# EAGLE design Amp_Circuit_Design_v8 (1) (EAGLE 9.6.2)
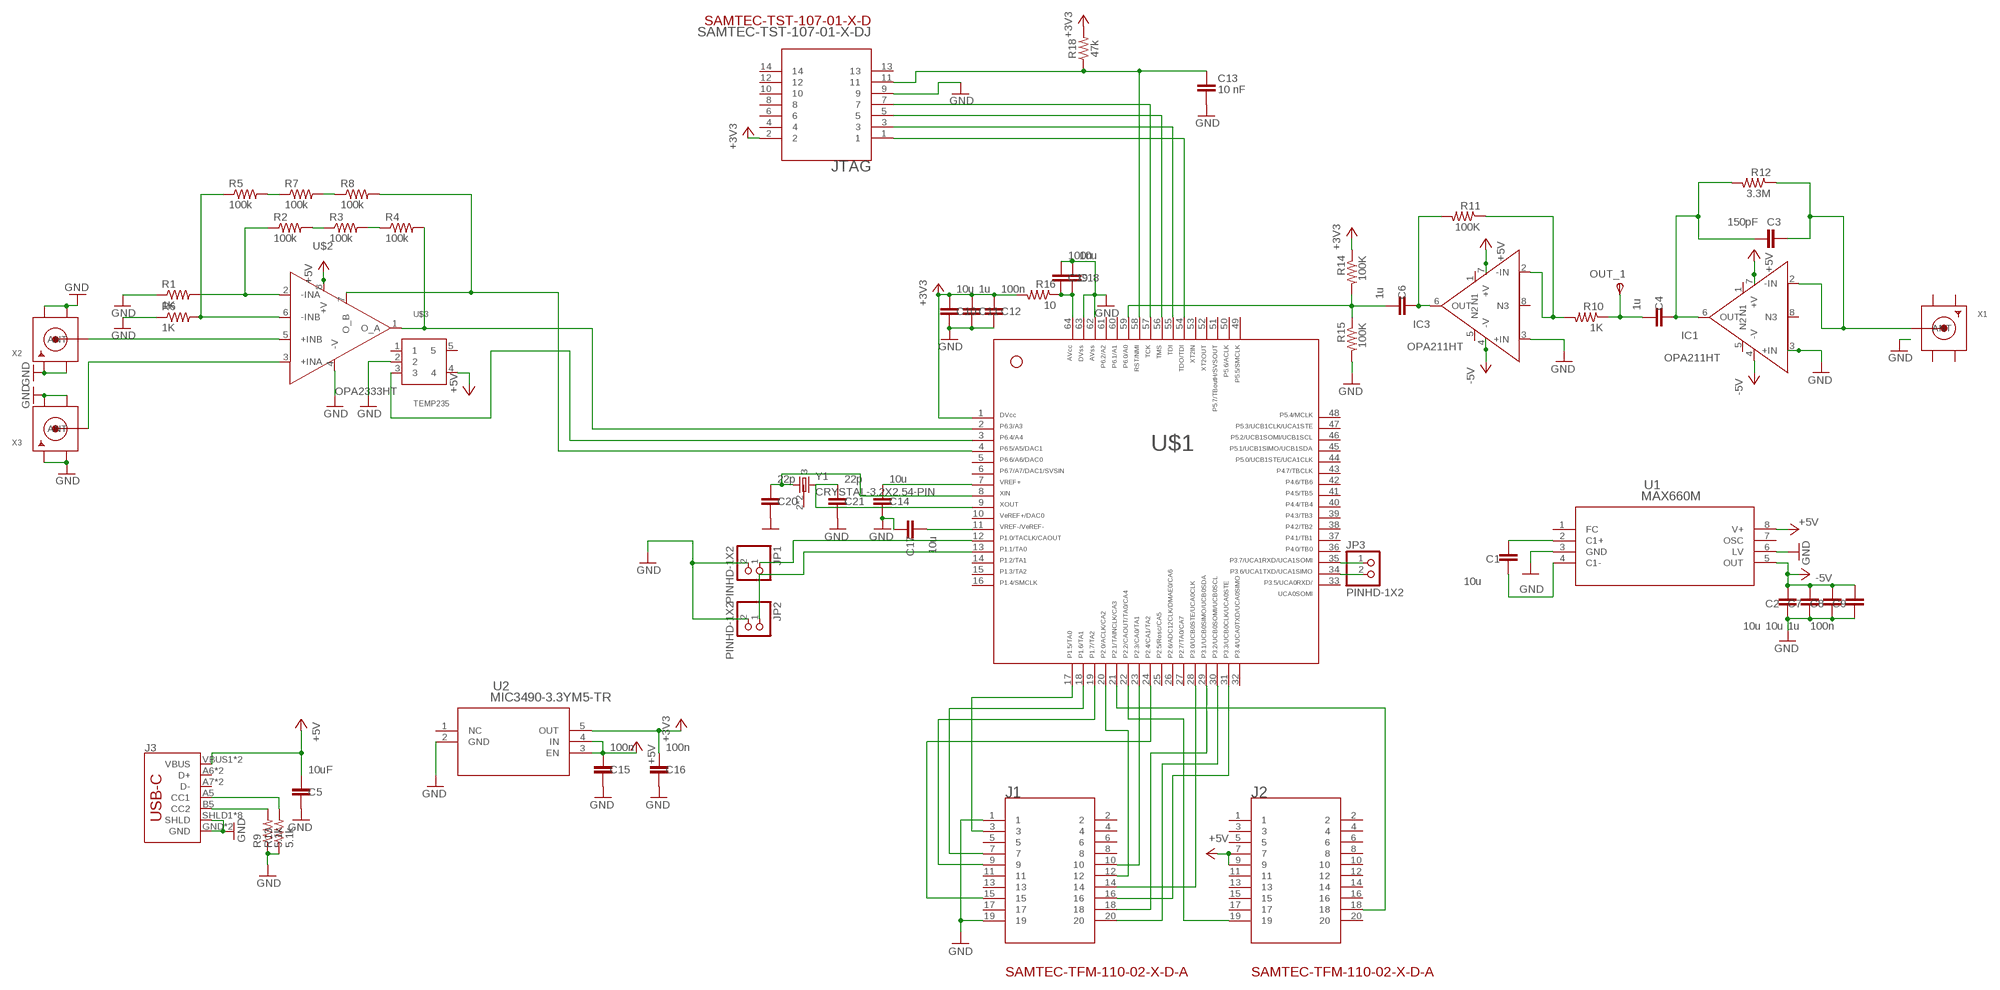
[diagram p0: schematic, sheet 1]

## Parts
C1  10u  C0603  [0603-C]
C2  10u  C0603  [0603-C]
C3  150pF  C0603  [0603-C]
C4  1u  C0603  [0603-C]
C5  10uF  C0603  [0603-C]
C6  1u  C0603  [0603-C]
C7  10u  C0603  [0603-C]
C8  1u  C0603  [0603-C]
C9  100n  C0603  [0603-C]
C10  10u  C0603  [0603-C]
C11  1u  C0603  [0603-C]
C12  100n  C0603  [0603-C]
C13  10 nF  C0603  [0603-C]
C14  10u  C0603  [0603-C]
C15  100n  C0603  [0603-C]
C16  100n  C0603  [0603-C]
C17  10u  C0603  [0603-C]
C18  10u  C0603  [0603-C]
C19  100n  C0603  [0603-C]
C20  22p  C0603  [0603-C]
C21  22p  C0603  [0603-C]
IC1  OPA211HT  [HKJ(R-CDFP-F8)]
IC3  OPA211HT  [HKJ(R-CDFP-F8)]
J1  SAMTEC-TFM-110-02-X-D-AJ  [SAMTEC-TFM-110-02-X-D-A]
J2  SAMTEC-TFM-110-02-X-D-AJ  [SAMTEC-TFM-110-02-X-D-A]
J3  SPARKFUN-CONNECTORS_USB_C16PIN  [SPARKFUN-CONNECTORS_USB-C-16P]
JP1  PINHD-1X2  [1X02]
JP2  PINHD-1X2  [1X02]
JP3  PINHD-1X2  [1X02]
JTAG  SAMTEC-TST-107-01-X-DJ  [SAMTEC-TST-107-01-X-D]
OUT_1  TPSB1,27  [B1,27]
R1  1K  R0603  [0603-R]
R2  100k  R0603  [0603-R]
R3  100k  R0603  [0603-R]
R4  100k  R0603  [0603-R]
R5  100k  R0603  [0603-R]
R6  1K  R0603  [0603-R]
R7  100k  R0603  [0603-R]
R8  100k  R0603  [0603-R]
R9  5.1k  R0603  [0603-R]
R10  1K  R0603  [0603-R]
R11  100K  R0603  [0603-R]
R12  3.3M  R0603  [0603-R]
R13  5.1k  R0603  [0603-R]
R14  100K  R0603  [0603-R]
R15  100K  R0603  [0603-R]
R16  10  R0603  [0603-R]
R18  47k  R0603  [0603-R]
U1  MAX660M  [M08A]
U2  MIC3490-3.3YM5-TR  [SOT-23-5_OT_MCH]
U$1  F261X---PM64  [PM/PAG64]
U$2  OPA2333HT  [D(R-PDSO-G8)]
U$3  TEMP235  [DCK(R-PDSO-G5)]
X1  SMACONNECTOR_EDGE  [SMA_EDGELAUNCH]
X2  SMACONNECTOR_EDGE  [SMA_EDGELAUNCH]
X3  SMACONNECTOR_EDGE  [SMA_EDGELAUNCH]
Y1  CRYSTAL-3.2X2.54-PIN  [XTAL-3.2X2.5]

## Nets
+3V3: C10.2 C11.2 C12.2 C16.2 JTAG.2 R14.1 R16.2 R18.2 U2.5(OUT) U$1.1
+5V: C5.2 C15.2 IC1.7(+V) IC3.7(+V) J2.7 J2.9 J3.VBUS1(VBUS) J3.VBUS2(VBUS) U1.8(V+) U2.3(EN) U2.4(IN) U$2.8(+V) U$3.4
-5V: C2.1 C7.1 C8.1 C9.1 IC1.4(-V) IC3.4(-V) U1.5(OUT)
GND: C2.2 C5.1 C7.2 C8.2 C9.2 C10.1 C11.1 C12.1 C13.2 C14.1 C15.1 C16.1 C17.1 C18.2 C19.2 C20.1 C21.1 IC1.3(+IN) IC3.3(+IN) J1.1 J1.19 J3.GND J3.GND2(GND) J3.SHLD1(SHLD) J3.SHLD2(SHLD) J3.SHLD3(SHLD) J3.SHLD4(SHLD) J3.SHLD5(SHLD) J3.SHLD6(SHLD) J3.SHLD7(SHLD) J3.SHLD8(SHLD) JP1.2 JP2.2 JTAG.9 R1.1 R6.1 R9.1 R13.1 R15.2 U1.3(GND) U1.6(LV) U2.2(GND) U$1.62 U$1.63 U$2.4(-V) U$3.2 X2.GND@1(GND4) X2.GND@2(GND3) X2.GND@3(GND2) X2.GND@4(GND1) X3.GND@1(GND4) X3.GND@2(GND3) X3.GND@3(GND2) X3.GND@4(GND1)
N$1: R8.2 U$1.4 U$2.7(O_B)
N$2: R4.2 U$1.2 U$2.1(O_A)
N$3: U$2.3(+INA) X3.P(ANT)
N$4: U$1.3 U$3.3
N$5: R1.2 R2.1 U$2.2(-INA)
N$6: R5.1 R6.2 U$2.6(-INB)
N$7: U$2.5(+INB) X2.P(ANT)
N$8: C1.1 U1.2(C1+)
N$9: C3.2 C4.1 IC1.6(OUT) R12.2
N$10: C4.2 OUT_1.TP(PP) R10.1
N$11: R5.2 R7.1
N$12: R2.2 R3.1
N$13: R3.2 R4.1
N$14: IC3.2(-IN) R10.2 R11.1
N$15: R7.2 R8.1
N$16: J3.B5(CC2) R9.2
N$17: C6.2 R14.2 R15.1 U$1.59
N$18: C3.1 IC1.2(-IN) R12.1 X1.P(ANT)
N$19: J1.14 U$1.28
N$20: J3.A5(CC1) R13.2
N$21: JP1.1 U$1.12
N$22: C14.2 U$1.7
N$23: J1.18 U$1.29
N$24: J1.20 U$1.30
N$25: C6.1 IC3.6(OUT) R11.2
N$26: J1.16 U$1.31
N$27: JTAG.1 U$1.54
N$28: JTAG.3 U$1.55
N$29: JTAG.5 U$1.56
N$30: JTAG.7 U$1.57
N$31: C1.2 U1.4(C1-)
N$32: JP3.1 U$1.35
N$33: C13.1 JTAG.11 R18.1 U$1.58
N$34: JP3.2 U$1.34
N$35: C20.2 U$1.8 Y1.1
N$36: C18.1 C19.1 R16.1 U$1.64
N$37: C17.2 U$1.11
N$38: JP2.1 U$1.13
N$39: J1.3 U$1.17
N$40: J1.7 U$1.18
N$41: J1.9 U$1.19
N$42: J1.12 U$1.20
N$43: J2.18 U$1.21
N$44: J2.19 U$1.22
N$45: J1.10 U$1.23
N$46: C21.2 U$1.9 Y1.3
N$47: J1.15 U$1.24
Unconnected: IC1.1(N1) IC1.5(N2) IC1.8(N3) IC3.1(N1) IC3.5(N2) IC3.8(N3) J1.2 J1.4 J1.5 J1.6 J1.8 J1.11 J1.13 J1.17 J2.1 J2.2 J2.3 J2.4 J2.5 J2.6 J2.8 J2.10 J2.11 J2.12 J2.13 J2.14 J2.15 J2.16 J2.17 J2.20 J3.A6(D+) J3.A7(D-) J3.B6(D+) J3.B7(D-) JTAG.4 JTAG.6 JTAG.8 JTAG.10 JTAG.12 JTAG.13 JTAG.14 U1.1(FC) U1.7(OSC) U2.1(NC) U$1.5 U$1.6 U$1.10 U$1.14 U$1.15 U$1.16 U$1.25 U$1.26 U$1.27 U$1.32 U$1.33 U$1.36 U$1.37 U$1.38 U$1.39 U$1.40 U$1.41 U$1.42 U$1.43 U$1.44 U$1.45 U$1.46 U$1.47 U$1.48 U$1.49 U$1.50 U$1.51 U$1.52 U$1.53 U$1.60 U$1.61 U$3.1 U$3.5 Y1.2 Y1.4

## Power pins joined to a net without a drawn wire
GND1: X1.GND@4(GND1)
GND2: X1.GND@3(GND2)
GND3: X1.GND@2(GND3)
GND4: X1.GND@1(GND4)

## Library data of the parts
C1-C21 = comma.ai:C
IC1 IC3 = Charge_amplifier:OPA211HT
J1 J2 = SAMTEC-TFM-110-02-X-D-A:SAMTEC-TFM-110-02-X-D-A
J3 = USB-C-Breakout:SPARKFUN-CONNECTORS_USB_C: USB Type C 16Pin Connector Super Speed pins not available on the 16-pin purely SMD connector so this part is best for USB 2.0 implementations. D1 and D2 are tied together enabling D+/- no matter which way the cable is plugged into the connector. The two channel configuration pins (CC1/2) are exposed. These are normally connected to ground via 5.1k resistors but can be reconfigured for high current/high power applications.; PROD_ID: CONN-14122
JP1-JP3 = Connector:PINHD-1X2: PIN HEADER; CATEGORY: CONNECTOR; SUB-CATEGORY: PIN-HEADER
JTAG = SAMTEC-TST-107-01-X-D:SAMTEC-TST-107-01-X-D; DESCRIPTION: TST - Samtec 2.54mm Shrouded Through Hole Terminal Strip Cable Mate; DIGI-KEY_PART_NUMBER: TST-107-01-G-D-01-ND; MF: Samtec; MP: TST-107-01-G-D; PACKAGE: None; PURCHASE-URL: https://pricing.snapeda.com/search/part/TST-107-01-G-D/?ref=eda
OUT_1 = testpad:TPS: TEST PIN
R1-R16 R18 = comma.ai:R
U1 = max660:MAX660M: Switched Capacitor Voltage Converter; BASE_PN: MAX660; COMPTYPE: SwitchCap; PARTNUMBER: MAX660M; SYMBOL: NameMAX660M; TYPE: MAX660M; VENDOR: NationalSemiconductor; VERSION: 05/02/2007
U2 = MIC3490:MIC3490-3.3YM5-TR: Linear Regulator; BUILT_BY: EMA_Cory; COPYRIGHT: Copyright (C) 2018 Accelerated Designs. All rights reserved; DATASHEET: http://ww1.microchip.com/downloads/en/DeviceDoc/MIC3490-Data-Sheet-DS20006137A.pdf; MANUFACTURER_PART_NUMBER: MIC3490-3.3YM5-TR; SOURCELIBRARY: Add_to_database_2021-04-16; VENDOR: Microchip
U$1 = TI_MSP430_v16:F261X---PM64: ***MSP430F261x***PM64
U$2 = Thermocouple:OPA2333HT
U$3 = Temp_sensor:TEMP235
X1-X3 = adafruit:SMACONNECTOR: SMA Connector 90° DIP SMA Connector, 50 Ohm (4UConnector: 07259)
Y1 = comma.ai:CRYSTAL-3.2X2.5

## Board
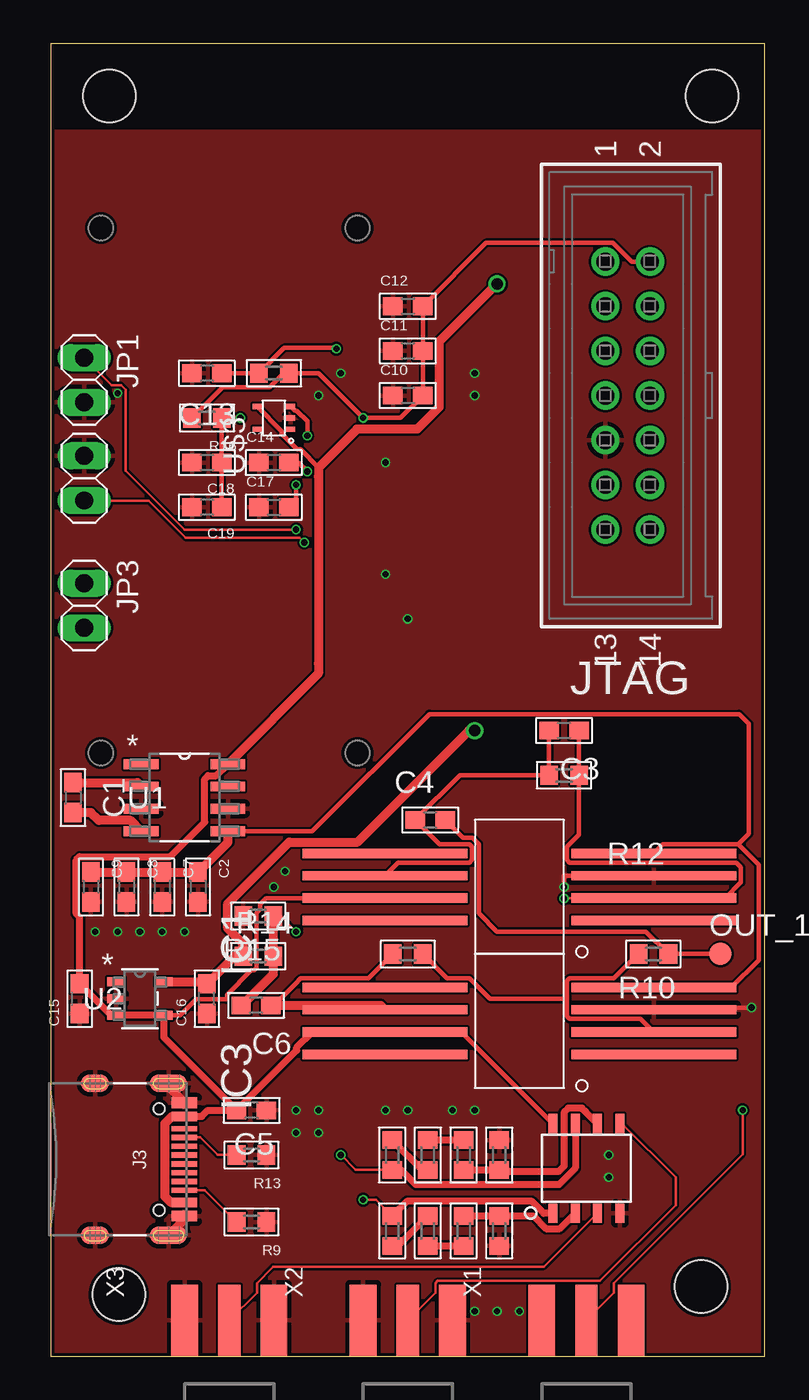
[diagram p1: board, top side]
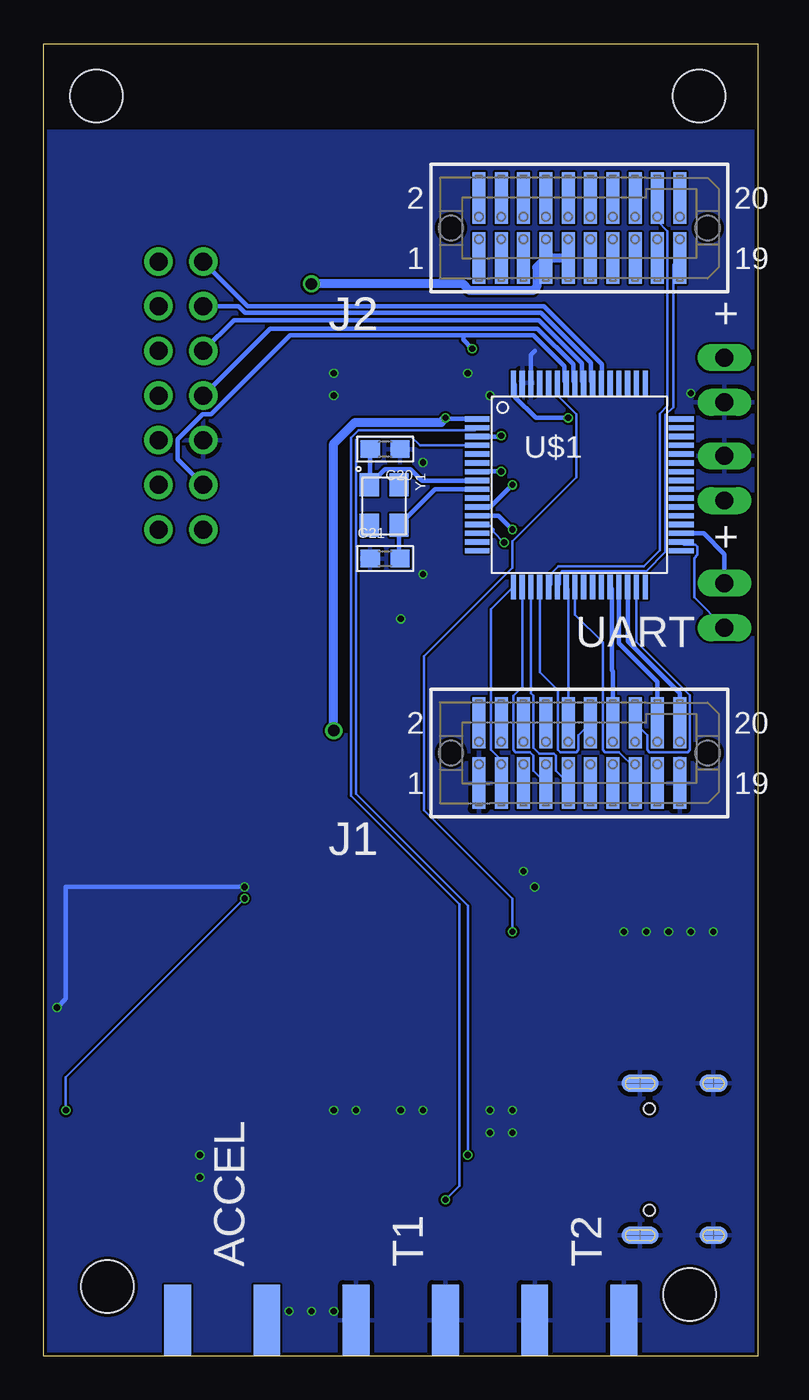
[diagram p2: board, bottom side, seen from below]

Size 40.62 x 74.6 mm. Coordinates in mm from the lower left corner, seen from the top.
Outline: 0,0 40.62,0 40.62,74.6 0,74.6 0,0
Copper layers (1*16): Top 0.035559375mm / dielectric 1.6mm / Bottom 0.035559375mm
Design rules "jlcpcb2layer": minimum track width 5mil, minimum drill 12mil, track to track 5mil, track to pad 5mil, pad to pad 5mil, via to via 5mil, smd to smd 5mil, copper to edge 8mil, drill to drill 6mil, minimum pad ring 5mil, minimum via ring 3mil, stop-mask expansion 2.5mil, vias tented up to drill 0mil, thermal gap 10mil
Holes 3 mm at 37,3.95 3.88,3.49 3.35,71.64 37.63,71.64

### Footprints (pad centres in the part's own frame; a part is rotated, then mirrored left to right if it is on the bottom)
0603-C = smd 1.1 x 1: 1 -0.85,0; 2 0.85,0
HKJ(R-CDFP-F8) = smd 0.53 x 9.4: 1 -1.905,-7.645; 2 -0.635,-7.645; 3 0.635,-7.645; 4 1.905,-7.645; 5 1.905,7.645; 6 0.635,7.645; 7 -0.635,7.645; 8 -1.905,7.645
SAMTEC-TFM-110-02-X-D-A = smd 0.74 x 2.92: 1 -5.715,-1.714; 2 -5.715,1.714; 3 -4.445,-1.714; 4 -4.445,1.714; 5 -3.175,-1.714; 6 -3.175,1.714; 7 -1.905,-1.714; 8 -1.905,1.714; 9 -0.635,-1.714; 10 -0.635,1.714; 11 0.635,-1.714; 12 0.635,1.714; 13 1.905,-1.714; 14 1.905,1.714; 15 3.175,-1.714; 16 3.175,1.714; 17 4.445,-1.714; 18 4.445,1.714; 19 5.715,-1.714; 20 5.715,1.714 | hole 1.4: 7.302,0; -7.302,0
SPARKFUN-CONNECTORS_USB-C-16P = smd 0.3 x 1.45: A5 -1.25,0; A6 -0.25,0; A7 0.25,0; A8 1.25,0; B5 1.75,0; B6 0.75,0; B7 -0.75,0; B8 -1.75,0 | smd 0.6 x 1.45: GND -3.225,0; GND2 3.225,0 | smd 1 x 2.1: SHLD1 -4.32,-0.915; SHLD2 4.32,-0.915 | smd 1 x 2.1 bottom: SHLD3 -4.32,-0.915; SHLD4 4.32,-0.915 | smd 1 x 1.6: SHLD5 -4.32,-5.095; SHLD8 4.32,-5.095 | smd 1 x 1.6 bottom: SHLD6 -4.32,-5.095; SHLD7 4.32,-5.095 | smd 0.55 x 1.45: VBUS1 -2.45,0; VBUS2 2.45,0 | hole 0.65: -2.89,-1.445; 2.89,-1.445
1X02 = drill 1.016 long: 1 -1.27,0; 2 1.27,0
SAMTEC-TST-107-01-X-D = drill 1.02 pad 1.62: 1 -7.62,-1.46; 2 -7.62,1.08; 3 -5.08,-1.46; 4 -5.08,1.08; 5 -2.54,-1.46; 6 -2.54,1.08; 7 0,-1.46; 8 0,1.08; 9 2.54,-1.46; 10 2.54,1.08; 11 5.08,-1.46; 12 5.08,1.08; 13 7.62,-1.46; 14 7.62,1.08
B1,27 = smd 1.27 x 1.27: TP 0,0
0603-R = smd 1 x 1.1: 1 -0.85,0; 2 0.85,0
M08A = smd 1.981 x 0.559: 1 -2.464,1.905; 2 -2.464,0.635; 3 -2.464,-0.635; 4 -2.464,-1.905; 5 2.464,-1.905; 6 2.464,-0.635; 7 2.464,0.635; 8 2.464,1.905
SOT-23-5_OT_MCH = smd 0.978 x 0.508: 1 -1.365,0.95; 2 -1.365,0; 3 -1.365,-0.95; 4 1.365,-0.95; 5 1.365,0.95
PM/PAG64 = smd 1.4 x 0.3: 1 -5.8,3.75; 2 -5.8,3.25; 3 -5.8,2.75; 4 -5.8,2.25; 5 -5.8,1.75; 6 -5.8,1.25; 7 -5.8,0.75; 8 -5.8,0.25; 9 -5.8,-0.25; 10 -5.8,-0.75; 11 -5.8,-1.25; 12 -5.8,-1.75; 13 -5.8,-2.25; 14 -5.8,-2.75; 15 -5.8,-3.25; 16 -5.8,-3.75; 33 5.8,-3.75; 34 5.8,-3.25; 35 5.8,-2.75; 36 5.8,-2.25; 37 5.8,-1.75; 38 5.8,-1.25; 39 5.8,-0.75; 40 5.8,-0.25; 41 5.8,0.25; 42 5.8,0.75; 43 5.8,1.25; 44 5.8,1.75; 45 5.8,2.25; 46 5.8,2.75; 47 5.8,3.25; 48 5.8,3.75 | smd 0.3 x 1.4: 17 -3.75,-5.8; 18 -3.25,-5.8; 19 -2.75,-5.8; 20 -2.25,-5.8; 21 -1.75,-5.8; 22 -1.25,-5.8; 23 -0.75,-5.8; 24 -0.25,-5.8; 25 0.25,-5.8; 26 0.75,-5.8; 27 1.25,-5.8; 28 1.75,-5.8; 29 2.25,-5.8; 30 2.75,-5.8; 31 3.25,-5.8; 32 3.75,-5.8; 49 3.75,5.8; 50 3.25,5.8; 51 2.75,5.8; 52 2.25,5.8; 53 1.75,5.8; 54 1.25,5.8; 55 0.75,5.8; 56 0.25,5.8; 57 -0.25,5.8; 58 -0.75,5.8; 59 -1.25,5.8; 60 -1.75,5.8; 61 -2.25,5.8; 62 -2.75,5.8; 63 -3.25,5.8; 64 -3.75,5.8
D(R-PDSO-G8) = smd 0.51 x 1.1: 1 -1.905,-2.55; 2 -0.635,-2.55; 3 0.635,-2.55; 4 1.905,-2.55; 5 1.905,2.55; 6 0.635,2.55; 7 -0.635,2.55; 8 -1.905,2.55
DCK(R-PDSO-G5) = smd 0.3 x 0.5: 1 -0.65,-0.95; 2 0,-0.95; 3 0.65,-0.95; 4 0.65,0.95; 5 -0.65,0.95
SMA_EDGELAUNCH = smd 4.064 x 1.524: GND@1 2.032,-2.54; GND@2 2.032,2.54 | smd 4.064 x 1.524 bottom: GND@3 2.032,2.54; GND@4 2.032,-2.54 | smd 4.064 x 1.27: P 2.032,0
XTAL-3.2X2.5 = smd 1.3 x 1.1: 1 0,-1.8; 2 2.3,-1.8; 3 2.3,-0.1; 4 0,-0.1

### Placement (x,y rotation side)
C1  1.27,31.75 270 top
C2  8.38,26.67 270 top
C3  29.21,35.56 180 top
C4  21.59,30.48 0 top
C5  11.43,13.97 180 top
C6  11.68,19.94 180 top
C7  6.35,26.67 270 top
C8  4.32,26.67 270 top
C9  2.29,26.67 270 top
C10  20.32,54.61 0 top
C11  20.32,57.15 0 top
C12  20.32,59.69 0 top
C13  8.89,55.88 180 top
C14  12.7,50.8 0 top
C15  1.65,20.32 90 top
C16  8.89,20.32 90 top
C17  12.7,48.26 0 top
C18  8.89,50.8 180 top
C19  8.89,48.26 180 top
C20  21.21,51.56 180 bottom
C21  21.21,45.34 0 bottom
IC1  26.67,26.67 90 top
IC3  26.67,19.05 90 top
J1  10.16,34.29 0 bottom
J2  10.16,64.14 0 bottom
J3  7.62,11.18 270 top
JP1  1.91,55.5 270 top
JP2  1.91,49.91 90 top
JP3  1.91,42.67 270 top
JTAG  33.02,54.61 270 top
OUT_1  38.1,22.86 0 top
R1  25.53,7.11 90 top
R2  23.5,7.11 270 top
R3  21.46,7.11 90 top
R4  19.43,7.11 90 top
R5  23.5,11.43 90 top
R6  25.53,11.43 270 top
R7  21.46,11.43 270 top
R8  19.43,11.43 270 top
R9  11.43,7.62 180 top
R10  34.29,22.86 180 top
R11  20.32,22.86 180 top
R12  29.21,33.02 180 top
R13  11.43,11.43 180 top
R14  11.81,22.73 0 top
R15  11.81,25.02 180 top
R16  8.89,53.34 180 top
R18  12.7,55.88 0 top
U1  7.62,31.75 0 top
U2  5.08,20.32 0 top
U$1  10.16,49.53 0 bottom
U$2  30.48,10.67 0 top
U$3  12.7,53.34 90 top
X1  30.48,0 90 top
X2  20.32,0 90 top
X3  10.16,0 90 top
Y1  20.32,49.53 270 bottom

### Tracks (layer width: path | path; a pad name or v marks a point on that pad's centre or on a via)
+3V3  (via drill 0.35, 0.65)
  Top 0.254: JTAG.2 33.06,62.23 32,63.29 24.77,63.29 C12.2 C11.2 C10.2 19.9,53.34 v17.78,53.34 15.24,55.88 R18.2 13.26,55.88 12.46,55.08 9.78,55.08 R16.2
  Top 0.508: U2.5 8.79,21.27 C16.2 10.45,22.73 R14.1 10.96,23.43 10.08,24.31 10.08,25.73 13.57,29.22 17.45,29.22 23.79,35.56 v24.13,35.56
  Bottom 0.254: v17.78,53.34 17.72,53.28 U$1.1
  Bottom 0.508: v17.78,53.34 18.03,53.09 22.91,53.09 24.13,51.87 v24.13,35.56
+5V  (via drill 0.65)
  Top 0.254: IC3.7 23.38,18.42 U$2.8 | IC1.7 12.27,26.04 11.91,25.67 11.91,25.4 11.71,25.21 11.71,22.08 11.57,21.93 11.41,21.93 10.03,20.54 10.03,20.32 9.98,20.27 8.29,20.27 7.38,19.37 U2.4 | U$3.4 13.15,52.59 13.15,52.44 14.03,51.55 14.21,51.55 15.24,50.52 15.24,39.37
  Top 0.406: J3.VBUS1 8.59,13.63 8.94,13.97 C5.2 | C5.2 6.45,18.11 U2.4 U2.3 3.45,19.37 C15.2 1.65,24.94 1.46,25.13 1.46,28.21 1.65,28.4 6.81,28.4 8.76,30.35 8.76,32.8 8.96,33 9.42,33 U1.8 | C5.2 13.99,17.39 13.99,17.55 14.86,18.42 IC3.7
  Top 0.508: J3.VBUS2 6.86,8.73 6.51,9.07 6.51,13.23 6.91,13.63 J3.VBUS1 | v25.4,60.96 22.1,57.66 22.1,53.95 20.84,52.7 17.43,52.7 15.25,50.52 15.25,50.03 15.24,50.02 15.24,39.37 15.24,38.81 U1.8
  Bottom 0.508: J2.9 J2.7 12.58,61.9 12.58,60.8 12.81,60.58 16.4,60.58 16.78,60.96 v25.4,60.96
-5V
  Top 0.254: IC3.4 38.73,20.96 40.29,22.51 40.29,27.92 39.12,29.09 | 39.12,29.09 34.83,29.09 IC1.4 | U1.5 14.89,29.85 21.54,36.5 39.17,36.5 39.73,35.95 39.73,29.7 39.12,29.09
  Top 0.508: C9.1 C8.1 C7.1 C2.1 10.08,29.22 U1.5
GND  (via drill 0.35)
  Top 0.254: IC1.3 29.21,27.3 v29.21,26.67 | v39.88,19.81 34.31,19.81 IC3.3
  Top 0.508: J3.GND 6.71,15.32 J3.SHLD1 | J3.GND2 7.62,7.77 J3.SHLD2
  Bottom 0.254: v29.21,26.67 39.37,26.67 39.37,20.32 v39.88,19.81 | U$1.62 12.91,56.94 12.7,57.15
  other vias: 2.54,24.13 3.81,24.13 5.08,24.13 6.35,24.13 7.62,24.13 19.05,50.8 3.81,54.74 12.7,26.67 13.34,27.56 31.75,10.16 31.75,11.43 24.13,13.97 22.86,13.97 20.32,13.97 19.05,13.97 15.24,13.97 13.97,13.97 13.97,12.7 15.24,12.7 15.24,54.61 16.51,55.88 24.13,55.88 24.13,54.61 19.05,44.45 20.32,41.91 24.13,2.54 25.4,2.54 26.67,2.54
  pour Bottom: 0,0 0,69.6 40.64,69.6 40.64,0
  pour Top: 0,0 0,69.6 40.64,69.6 40.64,0
N$1  (via drill 0.35)
  Top 0.152: v16.51,11.43 17.36,10.58 R8.2
  Top 0.406: R8.2 19.95,10.58 20.78,9.75 28.92,9.75 29.84,10.68 U$2.7
  Bottom 0.152: v16.51,11.43 16.51,25.6 22.87,31.97 22.87,52.09 22.69,52.27 19.73,52.27 19.24,51.78 U$1.4
N$2  (via drill 0.35)
  Top 0.152: v17.78,8.89 18.5,8.89 R4.2
  Top 0.406: U$2.1 28.06,8.12 27.38,8.79 20.26,8.79 R4.2
  Bottom 0.152: U$1.2 16.11,52.63 22.72,52.63 23.15,52.2 23.15,31.85 16.98,25.67 16.98,9.69 v17.78,8.89
N$3
  Top 0.152: X3.P 11.73,3.61 11.73,4.15 12.67,5.08 28.08,5.08 U$2.3
N$4  (via drill 0.35)
  Top 0.254: U$3.3 13.9,53.74 14.01,53.74 14.61,53.14 v14.61,52.32
  Bottom 0.254: v14.61,52.32 14.65,52.28 U$1.3
N$5
  Top 0.406: R2.1 R1.2 27.46,7.96 28.18,7.24 28.97,7.24 29.16,7.43 U$2.2
N$6
  Top 0.406: R5.1 R6.2 25.63,10.48 28.89,10.48 29.21,10.8 29.21,13.86 29.45,14.1 30.24,14.1 30.43,13.9 U$2.6
N$7
  Top 0.152: X2.P 21.89,3.61 21.89,4.15 22.01,4.27 31.26,4.27 35.56,8.57 35.56,10.16 32.5,13.22 U$2.5
N$8
  Top 0.508: C1.1 4.94,32.6 U1.2
N$9
  Top 0.254: IC1.6 19.78,28.06 23.83,28.06 23.98,28.21 23.98,28.94 23.83,29.09 22.13,29.09 C4.1 23.28,33.02 R12.2 C3.2
N$10
  Top 0.254: OUT_1.TP R10.1 33.87,24.13 25.4,24.13 24.36,25.17 24.36,29.1 23.99,29.47 23.45,29.47 C4.2
N$11
  Top 0.406: R5.2 R7.1
N$12
  Top 0.406: R3.1 R2.2
N$13
  Top 0.406: R3.2 19.76,6.26 R4.1
N$14
  Top 0.254: IC3.2 33.56,19.17 29.51,19.17 29.36,19.32 29.36,20.32 | R10.2 32.05,21.47 29.51,21.47 29.36,21.32 29.36,20.32 | R11.1 22.56,21.47 23.83,21.47 24.98,20.32 29.36,20.32
N$15
  Top 0.406: R8.1 21.13,10.58 R7.2
N$16
  Top 0.152: J3.B5 8.77,9.43 R9.2
N$17  (via drill 0.35)
  Top 0.152: R15.1 13.08,25.02 v13.97,24.13
  Top 0.508: R15.1 R14.2 12.66,21.72 10.88,19.94 C6.2
  Bottom 0.152: v13.97,24.13 13.97,26.01 18.99,31.03 18.99,39.79 13.97,44.81 13.97,46.33 10.33,49.97 10.33,53.53 11.41,54.61 U$1.59
N$18  (via drill 0.35)
  Top 0.152: X1.P 32.05,3.61 32.05,4.15 39.37,11.46 v39.37,13.97 | v29.21,26.02 34.3,26.02 IC1.2
  Top 0.254: C3.1 R12.1 30.06,29.64 29.36,28.94 29.36,28.21 29.51,28.06 39,28.06 39.27,27.79 39.27,26.93 38.37,26.04 IC1.2
  Bottom 0.152: v39.37,13.97 39.37,15.86 v29.21,26.02
N$19
  Bottom 0.254: J1.14 8.26,38.92 8.31,38.98 8.31,43.63 U$1.28
N$20
  Top 0.152: J3.A5 8.51,12.43 9.51,11.43 R13.2
N$21  (via drill 0.35)
  Top 0.152: v13.97,46.99 7.62,46.99 4.28,50.33 4.28,54.93 4,55.2 3.47,55.2 JP1.1
  Bottom 0.254: v13.97,46.99 14.76,47.78 U$1.12
N$22  (via drill 0.35)
  Top 0.254: C14.2 14.1,50.8 v14.61,50.29
  Bottom 0.254: v14.61,50.29 15.95,50.29 U$1.7
N$23
  Bottom 0.254: J1.18 5.73,36.02 5.73,38.33 7.91,40.52 U$1.29
N$24
  Bottom 0.254: J1.20 4.46,36.02 4.46,37.7 7.41,40.65 U$1.30
N$25
  Top 0.254: R11.2 18.08,21.47 14.22,21.47 14.07,21.32 14.07,21.31 12.7,19.94
  Top 0.508: C6.1 12.7,19.94 18.77,19.94 IC3.6
N$26
  Bottom 0.152: U$1.31 6.91,40.62 3.87,37.58 3.87,34.46 3.99,34.34 6.17,34.34 6.29,34.46 6.29,35.31 J1.16
N$27
  Bottom 0.254: JTAG.1 29.02,59.69 12.18,59.69 8.88,56.39 8.88,55.36 U$1.54
N$28
  Bottom 0.254: U$1.55 9.51,55.43 9.51,56.48 12.34,59.31 29.18,59.31 29.56,59.69 JTAG.3
N$29
  Bottom 0.254: U$1.56 10.01,55.43 10.01,56.44 12.47,58.9 29.81,58.9 JTAG.5
N$30
  Bottom 0.254: U$1.57 10.51,55.43 10.51,56.39 12.54,58.42 27.75,58.42 JTAG.7
N$31
  Top 0.508: U1.4 4.55,30.46 2.74,30.46 2.29,30.9 C1.2
N$32
  Bottom 0.254: U$1.35 3.09,46.78 1.91,45.59 JP3.1
N$33  (via drill 0.35)
  Top 0.254: C13.1 R18.1 13.29,57.32 16.21,57.32 v16.26,57.27
  Bottom 0.254: JTAG.11 33.02,50.99 33.02,52.12 31.59,53.55 31.12,53.55 26.63,58.04 16.76,58.04 | U$1.58 11.01,55.43 11.01,56.26 12.78,58.04 16.76,58.04 | 16.76,58.04 16.76,57.78 v16.26,57.27
N$34
  Bottom 0.152: U$1.34 4.21,46.13 3.58,46.13 3.46,46.01 3.46,45.55 3.63,45.37 3.63,43.13 JP3.2
N$35
  Bottom 0.254: C20.2 22.06,49.59 | 22.06,49.59 Y1.1 | U$1.8 19.11,49.78 19.77,50.43 21.22,50.43 22.06,49.59
N$36  (via drill 0.35)
  Top 0.254: C19.1 C18.1 R16.1 v10.79,53.34
  Bottom 0.254: U$1.64 13.81,55.23 13.81,54.53 12.63,53.34 v10.79,53.34
N$37  (via drill 0.35)
  Top 0.254: v13.97,49.53 13.97,48.68 C17.2
  Bottom 0.254: U$1.11 15.22,48.28 v13.97,49.53
N$38  (via drill 0.35)
  Top 0.152: JP2.1 5.57,48.64 7.69,46.52 14.16,46.52 v14.44,46.25
  Bottom 0.152: v14.44,46.25 15.06,46.87 15.06,47.01 15.32,47.28 U$1.13
N$39
  Bottom 0.152: J1.3 14.61,33.89 15.18,34.46 15.18,42.46 U$1.17
N$40
  Bottom 0.152: J1.7 12.76,33.27 12.76,34.12 12.98,34.34 13.79,34.34 13.91,34.46 13.91,37.55 13.41,38.05 U$1.18
N$41
  Bottom 0.152: J1.9 11.49,33.27 11.49,34.12 11.61,34.24 12.42,34.24 12.76,34.58 12.76,37.55 12.91,37.7 U$1.19
N$42
  Bottom 0.152: U$1.20 12.41,38.89 11.37,37.85 11.37,34.46 11.25,34.34 10.34,34.34 10.22,34.46 10.22,35.31 J1.12
N$43
  Bottom 0.152: U$1.21 11.76,43.88 11.76,44.51 11.37,44.91 6.48,44.91 5.59,45.8 5.59,53.59 5.14,54.03 5.14,63.97 5.71,64.54 J2.18
N$44
  Bottom 0.152: U$1.22 11.26,43.88 11.26,44.51 11.14,44.63 6.35,44.63 5.26,45.72 5.26,53.51 4.83,53.95 4.83,62.04 J2.19
N$45
  Bottom 0.152: J1.10 10.79,43.61 U$1.23
N$46
  Bottom 0.254: C21.2 20.42,45.4 Y1.3 18.37,49.28 U$1.9
N$47
  Bottom 0.152: U$1.24 10.41,42.16 8.83,40.58 8.83,34.46 8.71,34.34 7.9,34.34 6.99,33.42 J1.15

### Text on the board
bNames: + | + | UART | T2 | T1 | ACCEL